# EAGLE schematic Zuino XS PsyFi32 (EAGLE 8.4.1)
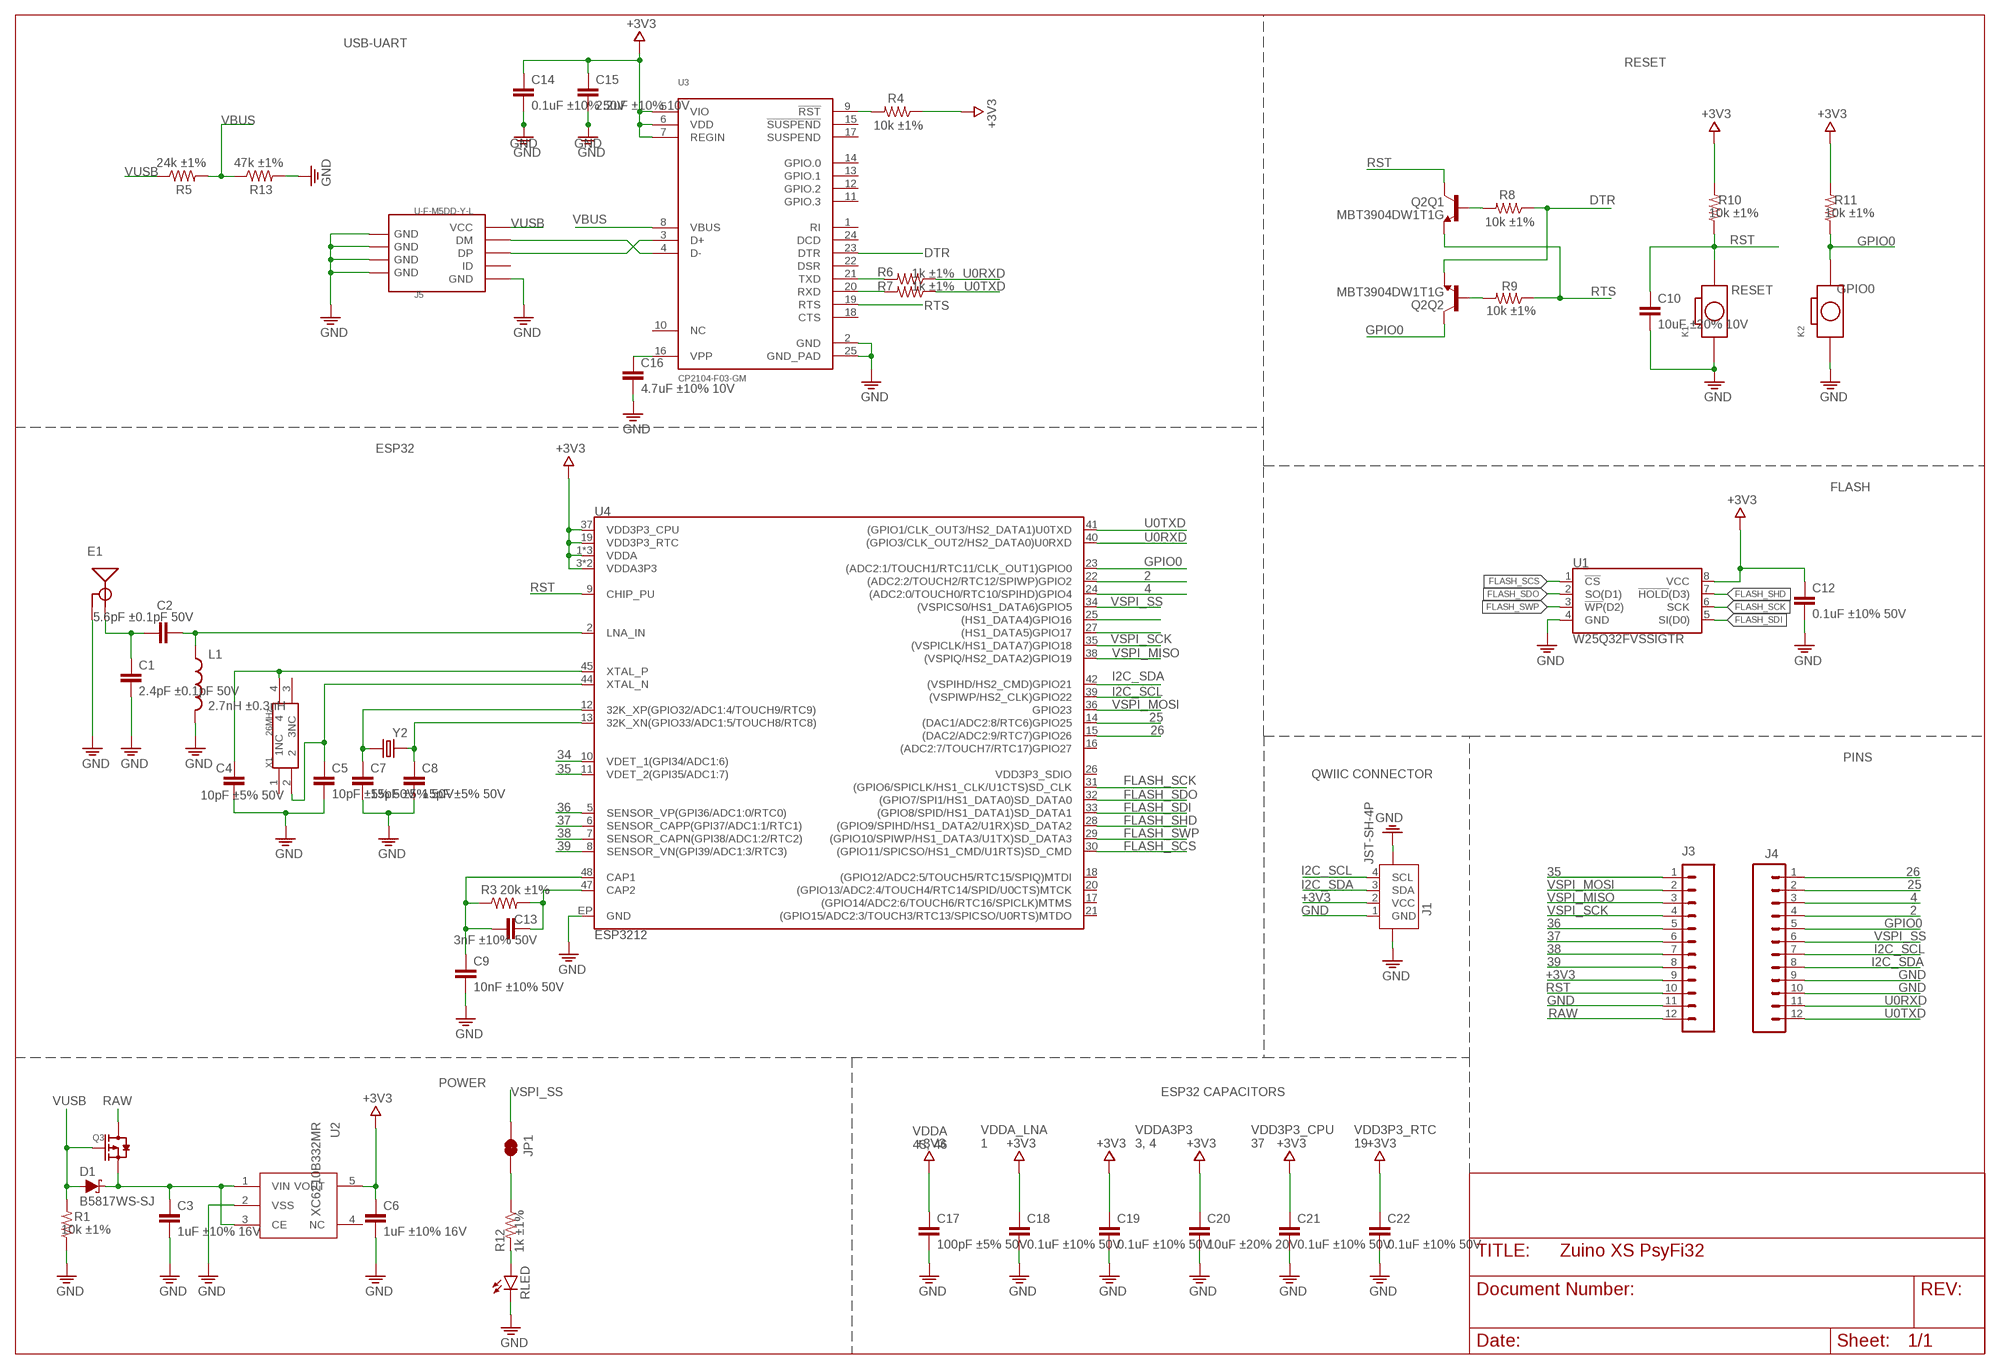
[diagram p0: schematic, sheet 1]

## Parts
C1  2.4pF ±0.1pF 50V  0.1UF  [YAGEO_C_0402]
C2  5.6pF ±0.1pF 50V  0.1UF  [YAGEO_C_0402]
C3  1uF ±10% 16V  0.1UF  [YAGEO_C_0402]
C4  10pF ±5% 50V  0.1UF  [YAGEO_C_0402]
C5  10pF ±5% 50V  0.1UF  [YAGEO_C_0402]
C6  1uF ±10% 16V  0.1UF  [YAGEO_C_0402]
C7  15pF ±5% 50V  0.1UF  [YAGEO_C_0402]
C8  15pF ±5% 50V  0.1UF  [YAGEO_C_0402]
C9  10nF ±10% 50V  0.1UF  [YAGEO_C_0402]
C10  10uF ±20% 10V  0.1UF  [YAGEO_C_0402]
C12  0.1uF ±10% 50V  0.1UF  [YAGEO_C_0402]
C13  3nF ±10% 50V  0.1UF  [YAGEO_C_0402]
C14  0.1uF ±10% 50V  0.1UF  [YAGEO_C_0402]
C15  2.2uF ±10% 10V  0.1UF  [YAGEO_C_0402]
C16  4.7uF ±10% 10V  0.1UF  [YAGEO_C_0402]
C17  100pF ±5% 50V  0.1UF  [YAGEO_C_0402]
C18  0.1uF ±10% 50V  0.1UF  [YAGEO_C_0402]
C19  0.1uF ±10% 50V  0.1UF  [YAGEO_C_0402]
C20  10uF ±20% 20V  0.1UF  [YAGEO_C_0402]
C21  0.1uF ±10% 50V  0.1UF  [YAGEO_C_0402]
C22  0.1uF ±10% 50V  0.1UF  [YAGEO_C_0402]
D1  B5817WS-SJ  DIODE-SCHOTTKY-BAT20J  [SOD-323]
D2  RLED  LED  [LED_HSMH-C190]
E1  ANTENNA-GROUNDED  [ANTENNA_ESP32]
J1  JST-SH-4P  [JST-SH-4P-90]
J3  CONN_12  [1X12]
J4  CONN_12  [1X12]
J5  U-F-M5DD-Y-L  USB-MICROE  [MICRO-SMD]
JP1  JUMPER-SMT_2_NC_TRACE_SILK  [SMT-JUMPER_2_NC_TRACE_SILK]
K1  BOTTON-2PSKRKAEE020  [SKRKAEE020]
K2  BOTTON-2PSKRKAEE020  [SKRKAEE020]
L1  2.7nH ±0.3nH  INDUCTOR  [INDUCTOR_HK10052N7S-T]
Q2  MBT3904DW1T1G  MBT3904DW1T1  [SC70-6]
Q3  MOSFET-P-323  [SOT-323]
R1  10k ±1%  RESISTOR  [YAGEO_R_0402]
R3  20k ±1%  RESISTOR  [YAGEO_R_0402]
R4  10k ±1%  RESISTOR  [YAGEO_R_0402]
R5  24k ±1%  RESISTOR  [YAGEO_R_0402]
R6  1k ±1%  RESISTOR  [YAGEO_R_0402]
R7  1k ±1%  RESISTOR  [YAGEO_R_0402]
R8  10k ±1%  RESISTOR  [YAGEO_R_0402]
R9  10k ±1%  RESISTOR  [YAGEO_R_0402]
R10  10k ±1%  RESISTOR  [YAGEO_R_0402]
R11  10k ±1%  RESISTOR  [YAGEO_R_0402]
R12  1k ±1%  RESISTOR  [YAGEO_R_0402]
R13  47k ±1%  RESISTOR  [YAGEO_R_0402]
U1  W25Q32FVSSIGTR  W25Q32FVSS  [SOIC-8]
U2  XC6210B332MR  XC6210  [SOT23-5]
U3  CP2104-F03-GM  [QFN24-CP2104]
U4  ESP3212  [QFN48-0.4MM]
X1  26MHz  CRYSTAL-XTAL-4P  [4P-SMD-2X1.6MM]
Y2  32.768kHz  CRYSTAL-Y2012  [CRYSTAL_2012]

## Nets
2: J4.4 U4.22((ADC2:2/TOUCH2/RTC12/SPIWP)GPIO2)
4: J4.3 U4.24((ADC2:0/TOUCH0/RTC10/SPIHD)GPIO4)
25: J4.2 U4.14((DAC1/ADC2:8/RTC6)GPIO25)
26: J4.1 U4.15((DAC2/ADC2:9/RTC7)GPIO26)
34: U4.10(VDET_1(GPI34/ADC1:6))
35: J3.1 U4.11(VDET_2(GPI35/ADC1:7))
36: J3.5 U4.5(SENSOR_VP(GPI36/ADC1:0/RTC0))
37: J3.6 U4.6(SENSOR_CAPP(GPI37/ADC1:1/RTC1))
38: J3.7 U4.7(SENSOR_CAPN(GPI38/ADC1:2/RTC2))
39: J3.8 U4.8(SENSOR_VN(GPI39/ADC1:3/RTC3))
+3V3: C6.1 C12.1 C14.1 C15.1 C17.1 C18.1 C19.1 C20.1 C21.1 C22.1 J1.2(VCC) J3.9 R4.1 R10.2 R11.2 U1.8(VCC) U2.5(VOUT) U3.5(VIO) U3.6(VDD) U3.7(REGIN) U4.1(VDDA) U4.3(VDDA3P3) U4.4(VDDA3P3) U4.19(VDD3P3_RTC) U4.37(VDD3P3_CPU) U4.43(VDDA) U4.46(VDDA)
DTR: Q2.1(Q2:E) R8.1 U3.23(DTR)
FLASH_SCK: U1.6(SCK) U4.31((GPIO6/SPICLK/HS1_CLK/U1CTS)SD_CLK)
FLASH_SCS: U1.1(!CS!) U4.30((GPIO11/SPICSO/HS1_CMD/U1RTS)SD_CMD)
FLASH_SDI: U1.5(SI(D0)) U4.33((GPIO8/SPID/HS1_DATA1)SD_DATA1)
FLASH_SDO: U1.2(SO(D1)) U4.32((GPIO7/SPI1/HS1_DATA0)SD_DATA0)
FLASH_SHD: U1.7(!HOLD!(D3)) U4.28((GPIO9/SPIHD/HS1_DATA2/U1RX)SD_DATA2)
FLASH_SWP: U1.3(!WP!(D2)) U4.29((GPIO10/SPIWP/HS1_DATA3/U1TX)SD_DATA3)
GND: C1.2 C3.2 C4.2 C5.2 C6.2 C7.2 C8.2 C9.2 C10.2 C12.2 C14.2 C15.2 C16.2 C17.2 C18.2 C19.2 C20.2 C21.2 C22.2 D2.1(C) E1.GND J1.1(GND) J1.5 J1.6 J3.11 J4.9 J4.10 J5.GND J5.S1(GND) J5.S1@1(GND) J5.S1@2(GND) J5.S2(GND) J5.S2@1(GND) J5.S2@2(GND) J5.S3(GND) J5.S3@1(GND) J5.S3@2(GND) J5.S4(GND) J5.S4@1(GND) J5.S4@2(GND) K1.1 K2.1 L1.2 R1.1 R13.2 U1.4(GND) U2.2(VSS) U3.2(GND) U3.25(GND_PAD) U4.EP(GND)
GPIO0: J4.5 K2.2 Q2.6(Q2:C) R11.1 U4.23((ADC2:1/TOUCH1/RTC11/CLK_OUT1)GPIO0)
I2C_SCL: J1.4(SCL) J4.7 U4.39((VSPIWP/HS2_CLK)GPIO22)
I2C_SDA: J1.3(SDA) J4.8 U4.42((VSPIHD/HS2_CMD)GPIO21)
N$1: C7.1 U4.12(32K_XP(GPIO32/ADC1:4/TOUCH9/RTC9)) Y2.1
N$2: C8.1 U4.13(32K_XN(GPIO33/ADC1:5/TOUCH8/RTC8)) Y2.2
N$3: C9.1 C13.1 R3.1 U4.48(CAP1)
N$4: C4.1 U4.45(XTAL_P) X1.4
N$5: C5.1 U4.44(XTAL_N) X1.2
N$6: C13.2 R3.2 U4.47(CAP2)
N$7: C1.1 C2.1 E1.ANT(SIGNAL)
N$8: C2.2 L1.1 U4.2(LNA_IN)
N$9: R6.2 U3.21(TXD)
N$10: U4.25((HS1_DATA4)GPIO16)
N$11: J5.D+(DP) U3.3(D+)
N$12: J5.D-(DM) U3.4(D-)
N$13: R4.2 U3.9(!RST)
N$14: U4.27((HS1_DATA5)GPIO17)
N$15: R7.2 U3.20(RXD)
N$16: Q2.2(Q2:B) R9.2
N$17: Q2.5(Q1:B) R8.2
N$18: D2.2(A) R12.2
N$19: C16.1 U3.16(VPP)
N$21: JP1.2 R12.1
RAW: J3.12 Q3.3(D)
RST: C10.1 J3.10 K1.2 Q2.3(Q1:C) R10.1 U4.9(CHIP_PU)
RTS: Q2.4(Q1:E) R9.1 U3.19(RTS)
U0RXD: J4.11 R6.1 U4.40((GPIO3/CLK_OUT2/HS2_DATA0)U0RXD)
U0TXD: J4.12 R7.1 U4.41((GPIO1/CLK_OUT3/HS2_DATA1)U0TXD)
VBUS: R5.2 R13.1 U3.8(VBUS)
VIN: C3.1 D1.C Q3.2(S) U2.1(VIN) U2.3(CE)
VSPI_MISO: J3.3 U4.38((VSPIQ/HS2_DATA2)GPIO19)
VSPI_MOSI: J3.2 U4.36(GPIO23)
VSPI_SCK: J3.4 U4.35((VSPICLK/HS1_DATA7)GPIO18)
VSPI_SS: J4.6 JP1.1 U4.34((VSPICS0/HS1_DATA6)GPIO5)
VUSB: D1.A J5.VBUS(VCC) Q3.1(G) R1.2 R5.1
Unconnected: J5.ID U2.4(NC) U3.1(RI) U3.10(NC) U3.11(GPIO.3) U3.12(GPIO.2) U3.13(GPIO.1) U3.14(GPIO.0) U3.15(!SUSPEND) U3.17(SUSPEND) U3.18(CTS) U3.22(DSR) U3.24(DCD) U4.16((ADC2:7/TOUCH7/RTC17)GPIO27) U4.17((GPIO14/ADC2:6/TOUCH6/RTC16/SPICLK)MTMS) U4.18((GPIO12/ADC2:5/TOUCH5/RTC15/SPIQ)MTDI) U4.20((GPIO13/ADC2:4/TOUCH4/RTC14/SPID/U0CTS)MTCK) U4.21((GPIO15/ADC2:3/TOUCH3/RTC13/SPICSO/U0RTS)MTDO) U4.26(VDD3P3_SDIO) X1.1(1NC) X1.3(3NC)

## Notes on the sheet
- USB-UART
- RESET
- RESET | GPIO0
- ESP32
- FLASH
- PINS
- QWIIC CONNECTOR
- POWER
- ESP32 CAPACITORS
- VDDA_LNA
  1
- VDDA3P3
  3, 4
- VDD3P3_CPU
  37
- VDD3P3_RTC
  19
- VDDA
  43, 46

## Library data of the parts
C1-C10 C12-C22 = yury-lbr:0.1UF: 0.1µF ceramic capacitors A capacitor is a passive two-terminal electrical component used to store electrical energy temporarily in an electric field.
D1 = SparkFun-DiscreteSemi:DIODE-SCHOTTKY: Schottky diode A Schottky diode is a semiconductor diode which has a low forward voltage drop and a very fast switching action.; PROD_ID: DIO-11623; VALUE: 1A/23V/620mV
D2 = yury-lbr:LED: LED (Generic) Standard schematic elements and footprints for 5mm, 3mm, 1206, and 0603 sized LEDs. Generic LEDs with no color specified.
E1 = yury-lbr:ANTENNA-GROUNDED: Antenna w/ Ground Connection 2.4GHz antennae with signal and ground terminals. TRACE_ANTENNA_2.4GHZ_15.2MM - Meander Trace antenna 15.2 x 5.7mm footprint Based on layout from TI app note AN043 <http://www.ti.com/lit/an/swra117d/swra117d.pdf>. TRACE_ANTENNA_2.4GHZ_25.7MM - Inverted F trace antenna 25.7 x 7.5 mm footprint. Based on layout from TI design note DN0007 <http://www.ti.com/lit/an/swru120b/swru120b.pdf>.
J1 = Connector:JST-SH-4P
J3 J4 = yury-lbr:CONN_12: Multi connection point. Often used as Generic Header-pin footprint for 0.1 inch spaced/style header connections On any of the 0.1 inch spaced packages, you can populate with these: Break Away Headers - Straight <https://www.sparkfun.com/products/116> (PRT-00116) Break Away Male Headers - Right Angle <https://www.sparkfun.com/products/553> (PRT-00553) Female Headers <https://www.sparkfun.com/products/115> (PRT-00115) Break Away Headers - Machine Pin <https://www.sparkfun.com/products/117> (PRT-00117) Break Away Female Headers - Swiss Machine Pin <https://www.sparkfun.com/products/743> (PRT-00743) For SCREWTERMINALS and SPRING TERMINALS visit here: Screw Terimnals on SparkFun.com <https://www.sparkfun.com/search/results?term=Screw+Terminals> (5mm/3.5mm/2.54mm spacing) This device is also useful as a general connection point to wire up your design to another part of your project. Our various solder wires solder well into these plated through hole pads. Hook-Up Wire - Assortment (Stranded, 22 AWG) <https://www.sparkfun.com/products/11375> (PRT-11375) Hook-Up Wire - Assortment (Solid Core, 22 AWG) <https://www.sparkfun.com/products/11367> (PRT-11367) View the entire wire category on our website here <https://www.sparkfun.com/categories/141> Special notes: Molex polarized connector foot print use with SKU : PRT-08231 with associated crimp pins and housings. 1MM SMD Version SKU: PRT-10208 NOTES ON THE VARIANTS LOCK and LOCK_LONGPADS... This footprint was designed to help hold the alignment of a through-hole component (i.e. 6-pin header) while soldering it into place. You may notice that each hole has been shifted either up or down by 0.005 of an inch from it's more standard position (which is a perfectly straight line). This slight alteration caused the pins (the squares in the middle) to touch the edges of the holes. Because they are alternating, it causes a "brace" to hold the component in place. 0.005 has proven to be the perfect amount of "off-center" position when using our standard breakaway headers. Although looks a little odd when you look at the bare footprint, once you have a header in there, the alteration is very hard to notice. Also,if you push a header all the way into place, it is covered up entirely on the bottom side.
J5 = Connector:USB-MICROE
JP1 = SparkFun-Jumpers:JUMPER-SMT_2_NC_TRACE: Normally closed trace jumper This jumper has a trace between two pads so it's normally closed (NC). Use a razor knife to open the connection. For best results follow the IPC guidelines for cutting traces: Cutout at least 0.063 mm (0.005 in). Remove all loose material to clean up the cut area. Seal the cut with an approved epoxy. Reapply solder to reclose the connection.
K1 K2 = Discrete:BOTTON-2P
L1 = yury-lbr:INDUCTOR: Inductors Basic Inductor/Choke - 0603 and 1206. Footprints are not proven and vary greatly between part numbers.; DIGIKEY: https://www.digikey.com/product-detail/en/taiyo-yuden/HK10052N7S-T/587-1505-1-ND/1008120
Q2 = esp32-thing-temp:MBT3904DW1T1: MBT3904DW1 Dual NPN Transistors The MBT3904W1 puts two general purpose 3904 NPN transistors in a single package. Datasheet <http://www.onsemi.com/pub_link/Collateral/MBT3904DW1T1-D.PDF>; DIGIKEY: https://www.digikey.com/product-detail/en/on-semiconductor/MBT3904DW1T1G/MBT3904DW1T1GOSCT-ND/918012; PROD_ID: TRANS-13337
Q3 = Discrete:MOSFET-P
R1 R3-R13 = yury-lbr:RESISTOR: Generic Resistor Package
U1 = SparkFun-DigitalIC:W25Q32FV: Winbond W25Q32FV 32Mbit (4MB) Flash The W25Q32FV support the standard Serial Peripheral Interface (SPI), Dual/Quad I/O SPI as well as 2-clocks instruction cycle Quad Peripheral Interface (QPI). Datasheet <http://www.winbond.com/resource-files/w25q32fv%20revh%20091613.pdf>; PROD_ID: IC-13229
U2 = IC:XC6210
U3 = yury-lbr:CP2104-F03-GM: CP2104-F03-GM. Datasheet: https://www.silabs.com/Support%20Documents/TechnicalDocs/cp2104.pdf; DIGIKEY: https://www.digikey.com/product-detail/en/silicon-labs/CP2104-F03-GM/336-2008-5-ND/2486177
U4 = yury-lbr:ESP3212; PROD_ID: IC-13338
X1 = Discrete:CRYSTAL-XTAL-4P
Y2 = Discrete:CRYSTAL*: CRYSTAL; DIGIKEY: https://www.digikey.com/product-detail/en/seiko-instruments/SC32S-12.5PF20PPM/728-1073-1-ND/4931507